# Altium project Simple_EEM_Controller.PrjPCB (part 1 of 5)
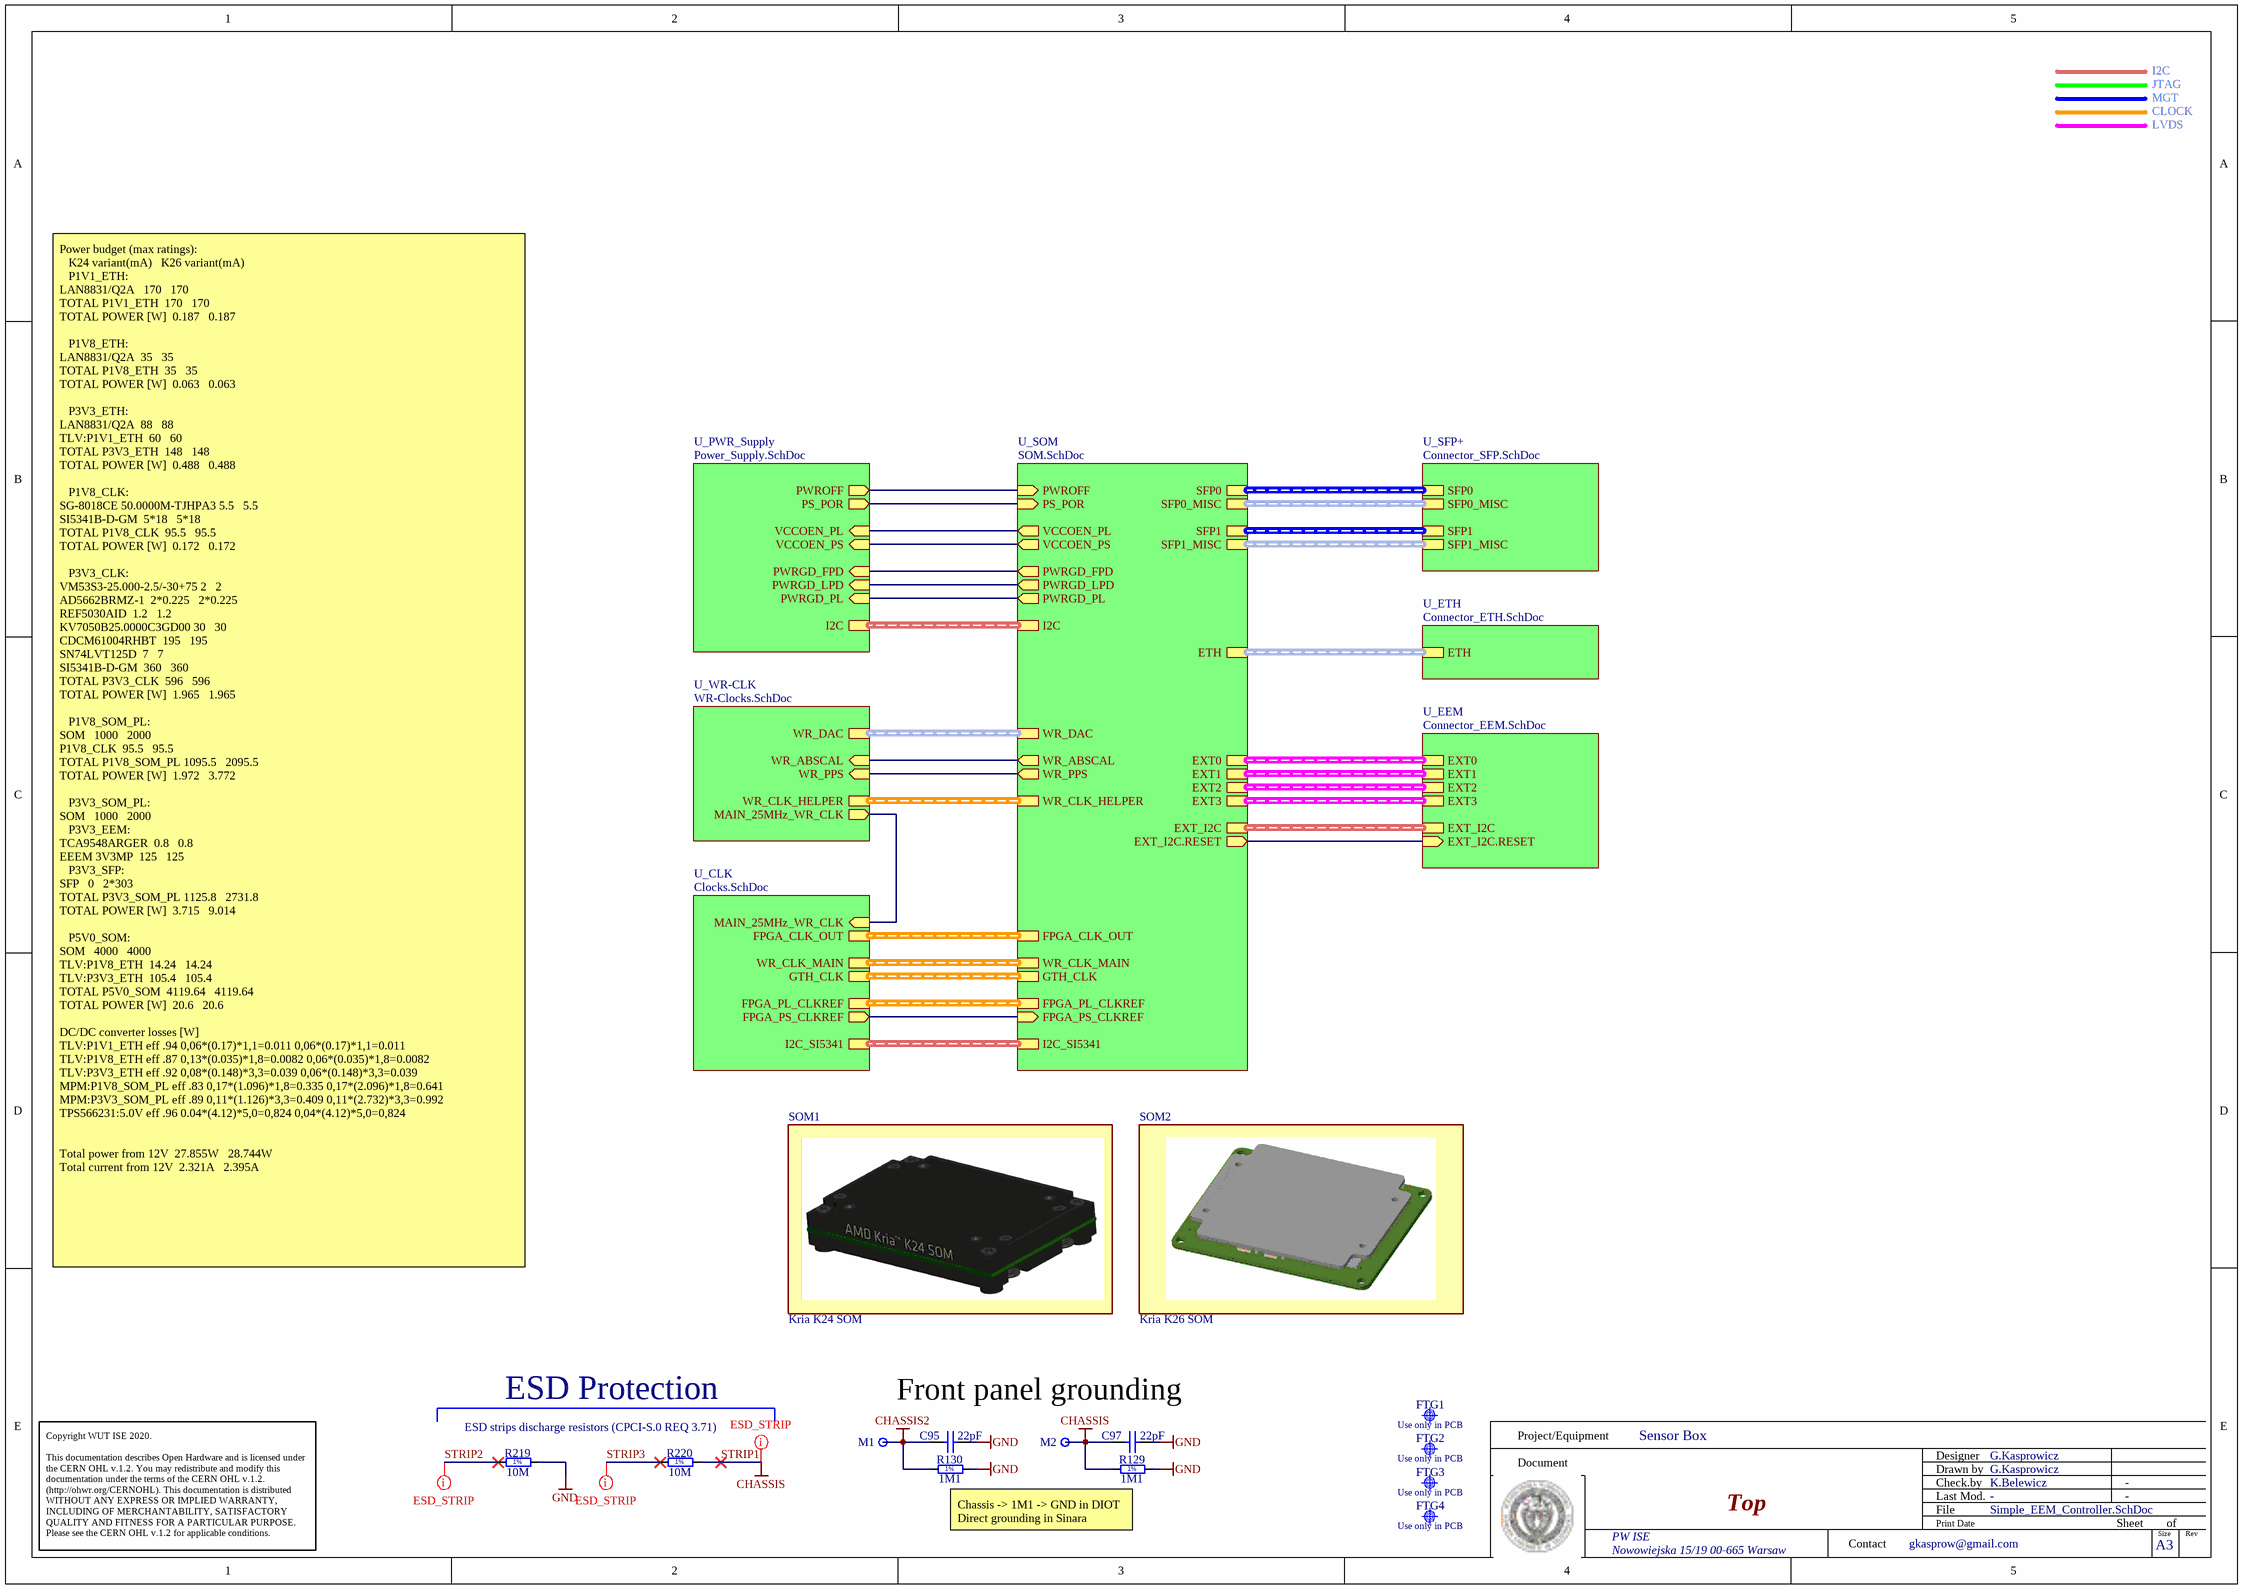
[diagram p0: Simple_EEM_Controller.SchDoc]
SheetTitle_Top: Simple EEM Controller; ProjectRev: 1.0; Project: Simple EEM Controller; CheckedBy: K.Belewicz
11 sheets, 476 parts. Net scope: hierarchical (ports join the sheet entries above them; power ports are global).
Board file: Simple_EEM_Controller.PcbDoc
Sheets:
  Simple_EEM_Controller.SchDoc
    U_SFP+ = Connector_SFP.SchDoc
    U_ETH = Connector_ETH.SchDoc
    U_EEM = Connector_EEM.SchDoc
    U_SOM = SOM.SchDoc
      Connector_SOM240_1 = Connector_SOM240_1.SchDoc
      Connector_SOM240_2 = Connector_SOM240_2.SchDoc
      Connector_SOM40 = Connector_SOM40.SchDoc
    U_PWR_Supply = Power_Supply.SchDoc
    U_CLK = Clocks.SchDoc
    U_WR-CLK = WR-Clocks.SchDoc

## Sheet Simple_EEM_Controller.SchDoc: =SheetTitle_Top
size 420 x 297 mm; EDA_Number: ARTIQ; Projet: Simple EEM Controller; Author: G.Kasprowicz; CompanyName: WUT ISE; DrawnBy: G.Kasprowicz; Organization: WUT ISE; Address1: PW ISE; Address2: Nowowiejska 15/19 00-665 Warsaw; Address3: gkasprow@gmail.com; Revision: 1.0; ModifiedBy: -; CheckedDate: -; Title2: Top; DivGrp: WUT ISE; Designer: G.Kasprowicz; ModifiedDate: -; ProjectName: Sensor Box

### Parts
C95  22pF  [CAPC1005X55N]
C97  22pF  [CAPC1005X55N]
FTG1  Use only in PCB  [FIDUCIAL_TOP_C100-200]  (no BOM)
FTG2  Use only in PCB  [FIDUCIAL_TOP_S100-200]  (no BOM)
FTG3  Use only in PCB  [FIDUCIAL_TOP_S100-200]  (no BOM)
FTG4  Use only in PCB  [FIDUCIAL_TOP_S100-200]  (no BOM)
M1  Plated Hole  [MTG300_600]  (value not drawn)  (no BOM)
M2  Plated Hole  [MTG300_600]  (value not drawn)  (no BOM)
R129  1M1  [RESC2012X60N]
R130  1M1  [RESC2012X60N]
R219  10M  [RESC2113X55N]
R220  10M  [RESC2113X55N]
SOM1  Kria K24 SOM  [Kria K24 SOM]
SOM2  Kria K26 SOM  [Kria K26 SOM]

### Sub-sheets
U_CLK = Clocks.SchDoc: GTH_CLK (harness GTH_CLK), MAIN_25MHz_WR_CLK (in), I2C_SI5341 (harness I2C), FPGA_PS_CLKREF (out), FPGA_PL_CLKREF (harness CLK_DIFF), FPGA_CLK_OUT (harness CLK_DIFF), WR_CLK_MAIN (harness CLK_DIFF)
U_EEM = Connector_EEM.SchDoc: EXT_I2C.RESET (in), EXT_I2C (harness EEM_I2C), EXT2 (harness EEM_LVDS), EXT0 (harness EEM_LVDS), EXT1 (harness EEM_LVDS), EXT3 (harness EEM_LVDS)
U_ETH = Connector_ETH.SchDoc: ETH (harness ETH)
U_PWR_Supply = Power_Supply.SchDoc: PWROFF (out), PS_POR (out), VCCOEN_PL (in), VCCOEN_PS (in), PWRGD_FPD (in), PWRGD_LPD (in), PWRGD_PL (in), I2C (harness I2C)
U_SFP+ = Connector_SFP.SchDoc: SFP0 (harness SFP), SFP0_MISC (harness SFP_MISC), SFP1 (harness SFP), SFP1_MISC (harness SFP_MISC)
U_SOM = SOM.SchDoc: SFP0 (harness SFP), SFP0_MISC (harness SFP_MISC), SFP1 (harness SFP), SFP1_MISC (harness SFP_MISC), ETH (harness ETH), EXT2 (harness EEM_LVDS), EXT0 (harness EEM_LVDS), EXT1 (harness EEM_LVDS), EXT3 (harness EEM_LVDS), EXT_I2C (harness EEM_I2C), PWROFF (in), PS_POR (in), PWRGD_FPD (out), VCCOEN_PS (out), PWRGD_PL (out), PWRGD_LPD (out), VCCOEN_PL (out), EXT_I2C.RESET (out), I2C (harness I2C), GTH_CLK (harness GTH_CLK), WR_ABSCAL (out), WR_PPS (out), WR_CLK_HELPER (harness CLK_DIFF), FPGA_PS_CLKREF (in), WR_DAC (harness WR_DAC_H), FPGA_PL_CLKREF (harness CLK_DIFF), WR_CLK_MAIN (harness CLK_DIFF), FPGA_CLK_OUT (harness CLK_DIFF), I2C_SI5341 (harness I2C)
U_WR-CLK = WR-Clocks.SchDoc: WR_DAC (harness WR_DAC_H), WR_CLK_HELPER (harness CLK_DIFF), WR_PPS (in), WR_ABSCAL (in), MAIN_25MHz_WR_CLK (out)

### Nets
CHASSIS: C97.1 M2.1 R129.1 R220.2  [also labelled STRIP1]
CHASSIS2: C95.1 M1.1 R130.1
GND: C95.2 C97.2 R129.2 R130.2 R219.2
EXT_I2C.RESET: sheet U_EEM/EXT_I2C.RESET, sheet U_SOM/EXT_I2C.RESET
HDA.HDA00_CC: sheet U_SOM/WR_ABSCAL, sheet U_WR-CLK/WR_ABSCAL
HDA.HDA01: sheet U_SOM/WR_PPS, sheet U_WR-CLK/WR_PPS
MAIN_25MHz_WR_CLK: sheet U_CLK/MAIN_25MHz_WR_CLK, sheet U_WR-CLK/MAIN_25MHz_WR_CLK
MIO46: sheet U_SOM/FPGA_PS_CLKREF, sheet U_CLK/FPGA_PS_CLKREF
PS_POR: sheet U_SOM/PS_POR, sheet U_PWR_Supply/PS_POR
PWRGD_FPD_M2C: sheet U_SOM/PWRGD_FPD, sheet U_PWR_Supply/PWRGD_FPD
PWRGD_LPD_M2C: sheet U_SOM/PWRGD_LPD, sheet U_PWR_Supply/PWRGD_LPD
PWRGD_PL_M2C: sheet U_SOM/PWRGD_PL, sheet U_PWR_Supply/PWRGD_PL
PWROFF_C2M: sheet U_SOM/PWROFF, sheet U_PWR_Supply/PWROFF
STRIP2: R219.1
STRIP3: R220.1
VCCOEN_PL_M2C: sheet U_SOM/VCCOEN_PL, sheet U_PWR_Supply/VCCOEN_PL
VCCOEN_PS_M2C: sheet U_SOM/VCCOEN_PS, sheet U_PWR_Supply/VCCOEN_PS

### Buses and harness runs
harness sheet U_CLK/FPGA_CLK_OUT = sheet U_SOM/FPGA_CLK_OUT
harness sheet U_CLK/FPGA_PL_CLKREF = sheet U_SOM/FPGA_PL_CLKREF
harness sheet U_CLK/GTH_CLK = sheet U_SOM/GTH_CLK
harness sheet U_CLK/I2C_SI5341 = sheet U_SOM/I2C_SI5341
harness sheet U_CLK/WR_CLK_MAIN = sheet U_SOM/WR_CLK_MAIN
harness sheet U_EEM/EXT0 = sheet U_SOM/EXT0
harness sheet U_EEM/EXT1 = sheet U_SOM/EXT1
harness sheet U_EEM/EXT2 = sheet U_SOM/EXT2
harness sheet U_EEM/EXT3 = sheet U_SOM/EXT3
harness sheet U_EEM/EXT_I2C = sheet U_SOM/EXT_I2C
harness sheet U_ETH/ETH = sheet U_SOM/ETH
harness sheet U_PWR_Supply/I2C = sheet U_SOM/I2C
harness sheet U_SFP+/SFP0 = sheet U_SOM/SFP0
harness sheet U_SFP+/SFP0_MISC = sheet U_SOM/SFP0_MISC
harness sheet U_SFP+/SFP1 = sheet U_SOM/SFP1
harness sheet U_SFP+/SFP1_MISC = sheet U_SOM/SFP1_MISC
harness sheet U_SOM/WR_CLK_HELPER = sheet U_WR-CLK/WR_CLK_HELPER
harness sheet U_SOM/WR_DAC = sheet U_WR-CLK/WR_DAC

### Layout directives
net class ESD_STRIP: CHASSIS, STRIP2, STRIP3

### Notes on the sheet
- I2C
- JTAG
- MGT
- CLOCK
- LVDS
- Power budget (max ratings):
  K24 variant(mA)	 	K26 variant(mA)
  P1V1_ETH:
  LAN8831/Q2A 		170			170
  TOTAL P1V1_ETH		170			170
  TOTAL POWER [W]		0.187			0.187
  P1V8_ETH:
  LAN8831/Q2A		35			35
  TOTAL P1V8_ETH		35			35
  TOTAL POWER [W]		0.063			0.063
  P3V3_ETH:
  LAN8831/Q2A		88			88
  TLV:P1V1_ETH		60			60
  TOTAL P3V3_ETH		148			148
  TOTAL POWER [W]		0.488			0.488
  P1V8_CLK:
  SG-8018CE 50.0000M-TJHPA3	5.5			5.5
  SI5341B-D-GM		5*18			5*18
  TOTAL P1V8_CLK		95.5			95.5
  TOTAL POWER [W]		0.172			0.172
  P3V3_CLK:
  VM53S3-25.000-2.5/-30+75	2			2
  AD5662BRMZ-1		2*0.225			2*0.225
  REF5030AID		1.2			1.2
  KV7050B25.0000C3GD00	30			30
  CDCM61004RHBT		195			195
  SN74LVT125D		7			7
  SI5341B-D-GM		360			360
  TOTAL P3V3_CLK		596			596
  TOTAL POWER [W]		1.965			1.965
  P1V8_SOM_PL:
  SOM			1000			2000
  P1V8_CLK		95.5			95.5
  TOTAL P1V8_SOM_PL	1095.5			2095.5
  TOTAL POWER [W]		1.972			3.772
  P3V3_SOM_PL:
  SOM			1000			2000
  P3V3_EEM:
  TCA9548ARGER		0.8			0.8
  EEEM 3V3MP		125			125
  P3V3_SFP:
  SFP			0			2*303
  TOTAL P3V3_SOM_PL	1125.8			2731.8
  TOTAL POWER [W]		3.715			9.014
  P5V0_SOM:
  SOM			4000			4000
  TLV:P1V8_ETH		14.24			14.24
  TLV:P3V3_ETH		105.4			105.4
  TOTAL P5V0_SOM		4119.64			4119.64
  TOTAL POWER [W]		20.6			20.6
  DC/DC converter losses [W]
  TLV:P1V1_ETH eff .94	0,06*(0.17)*1,1=0.011	0,06*(0.17)*1,1=0.011
  TLV:P1V8_ETH eff .87	0,13*(0.035)*1,8=0.0082	0,06*(0.035)*1,8=0.0082
  TLV:P3V3_ETH eff .92	0,08*(0.148)*3,3=0.039	0,06*(0.148)*3,3=0.039
  MPM:P1V8_SOM_PL eff .83	0,17*(1.096)*1,8=0.335	0,17*(2.096)*1,8=0.641
  MPM:P3V3_SOM_PL eff .89	0,11*(1.126)*3,3=0.409	0,11*(2.732)*3,3=0.992
  TPS566231:5.0V eff .96	0.04*(4.12)*5,0=0,824	0,04*(4.12)*5,0=0,824
  Total power from 12V 	27.855W			28.744W
  Total current from 12V 	2.321A			2.395A
- ESD Protection
- Front panel grounding
- ESD strips discharge resistors (CPCI-S.0 REQ 3.71)
- Chassis -> 1M1 -> GND in DIOT
  Direct grounding in Sinara
- Project/Equipment
- Document
- Designer
- Drawn by
- Check.by
- Copyright WUT ISE 2020.
  This documentation describes Open Hardware and is licensed under the CERN OHL v.1.2. You may redistribute and modify this documentation under the terms of the CERN OHL v.1.2. (http://ohwr.org/CERNOHL). This documentation is distributed WITHOUT ANY EXPRESS OR IMPLIED WARRANTY, INCLUDING OF MERCHANTABILITY, SATISFACTORY QUALITY AND FITNESS FOR A PARTICULAR PURPOSE. Please see the CERN OHL v.1.2 for applicable conditions.
- Contact
- File
- Last Mod.
- Print Date
- Sheet
- Size
- A3
- of
- Rev
- (in symbol R0805_1M1_1%_0.125W_100PPM) 1%
- (in symbol R0805_10M_1%_0.125W_100PPM_VISHAY_CRCW e3) 1%

### Library data of the parts
C95 C97 = CC0402_22PF_50V_5%_C0G: Non-polarised capacitor; Part Description: SMD Multilayer Chip Ceramic Capacitor; Manufacturer: GENERIC; Manufacturer1 Part Number: C0402C220J5GACTU; Voltage: 50V; TC: C0G/NP0; Tolerance: ±5%; Part Number: CC0402_22PF_50V_5%_C0G; Component Kind: Standard; Component Type: Standard; Pin Count: 2; Value: 22pF; Status: Preferred; Manufacturer Part Number: CC0402_22PF_50V_5%_C0G; Case: 0402; Mounted: Yes; Socket: No; SMD: Yes; Manufacturer1 Example: KEMET; Manufacturer1 ComponentHeight: 0.55mm; HelpURL: \\cern.ch\dfs\Applications\Altium\Datasheets\CC0402_C0G_KEMET_(Commercial Grade).pdf; Author: CERN DEM JLC; CreateDate: 2007-12-03; LatestRevisionDate: 2007-12-03; Sense: No
FTG1 = FIDUCIAL_TARGET_C100-200: Fiducial Target; Part Description: Round Fiducial Target, Top Layer, 1.0mm, Top Solder 2.0mm, Keepout =2.0mm; Mounted: No; Part Number: FIDUCIAL_TARGET_C100-200; Component Type: Standard (No BOM); Pin Count: 1; Family: Fiducial; Socket: No; SMD: Yes; Sense: No; Status: None; ComponentHeight: 0mm; HelpURL: Undefined; Author: CERN DEM JLC; CreateDate: 09.02.2010; LatestRevisionDate: 04.04.2012; PackageDescription: Round Fiducial Target, Top Layer, 1.0mm, Top Solder 2.0mm, Keepout =2.0mm
FTG2-FTG4 = FIDUCIAL_TARGET_S100-200: Fiducial Target; Part Description: Square Fiducial Target, Top Layer, 1.0mm, Top Solder 2.0mm, Keepout =2.0mm; Mounted: No; Part Number: FIDUCIAL_TARGET_S100-200; Component Type: Standard (No BOM); Pin Count: 1; Family: Fiducial; Socket: No; SMD: Yes; Sense: No; Status: None; ComponentHeight: 0mm; HelpURL: Undefined; Author: CERN DEM JLC; CreateDate: 09.02.2010; LatestRevisionDate: 04.04.2012; PackageDescription: Square Fiducial Target, Top Layer, 1.0mm, Top Solder 2.0mm, Keepout =2.0mm
M1 M2 = PLATED_HOLE3.0_PAD6.0: Single Terminal Socket; Part Description: Plated Through Hole: Hole Dia.=3.0mm Pad Dia.=6.0mm; Mounted: No; Table: Pads; Part Number: PLATED_HOLE3.0_PAD6.0; Component Type: Standard (No BOM); Designator: Single Terminal Socket; Library Reference: Single Terminal Socket; Pin Count: 1; Family: Plated Hole; Socket: No; SMD: No; Status: None; ComponentHeight: 0mm; Author: CERN DEM JLC; CreateDate: 26.05.2008; LatestRevisionDate: 26.05.2008; PackageDescription: Plated Through Hole: Hole Dia.=3.0mm Pad Dia.=6.0mm
R129 R130 = R0805_1M1_1%_0.125W_100PPM: Resistor - 1%; Part Description: General Purpose Thick Film Chip Resistor; Manufacturer: GENERIC; Manufacturer1 Part Number: NRC10F1104TRF; PressFit: No; Part Number: R0805_1M1_1%_0.125W_100PPM; Component Kind: Standard; Component Type: Standard; Pin Count: 2; Value: 1M1; Status: Preferred; Manufacturer Part Number: R0805_1M1_1%_0.125W_100PPM; Case: 0805; Mounted: Yes; Sense: No; Socket: No; SMD: Yes; Manufacturer1 Example: NIC COMPONENT; Manufacturer1 ComponentHeight: 0.6mm; HelpURL: \\cern.ch\dfs\Applications\Altium\Datasheets\R0805_NIC_NRC.pdf; Author: CERN DEM JLC; CreateDate: 03/12/2007; LatestRevisionDate: 13/03/2008
R219 R220 = R0805_10M_1%_0.125W_100PPM_VISHAY_CRCW e3: Resistor - 1%; Part Description: 150V, Standard Thick Film Chip Resistor; Manufacturer: VISHAY DALE; Manufacturer Part Number: CRCW080510M0FKEA; Power: 0.125W; TC: ±100ppm/°C; PressFit: No; Part Number: R0805_10M_1%_0.125W_100PPM_VISHAY_CRCW e3; Component Kind: Standard; Component Type: Standard; Pin Count: 2; Value: 10M; Status: None; Tolerance: ±1%; Case: 0805; Mounted: Yes; Sense: No; Socket: No; SMD: Yes; ComponentHeight: 0.5mm; HelpURL: \\cern.ch\dfs\Applications\Altium\Datasheets\R0805_VISHAY_CRCW e3.pdf; Author: CERN DEM BC; CreateDate: 2019-11-12; LatestRevisionDate: 2019-11-12
SOM1 = K24: Manufacturer: AMD; Part Number: Kria K24 SOM
SOM2 = K26: Manufacturer: AMD; Part Number: Kria K26 SOM

## Sheet Connector_SFP.SchDoc: =SheetTitle_Top
size 420 x 297 mm; EDA_Number: ARTIQ; Projet: Simple EEM Controller; Author: G.Kasprowicz; CompanyName: WUT ISE; DrawnBy: G.Kasprowicz; Organization: WUT ISE; Address1: PW ISE; Address2: Nowowiejska 15/19 00-665 Warsaw; Address3: gkasprow@gmail.com; Revision: 1.0; ModifiedBy: -; CheckedDate: -; Title2: Connector SFP+; DivGrp: WUT ISE; Designer: G.Kasprowicz; ModifiedDate: -; ProjectName: Sensor Box
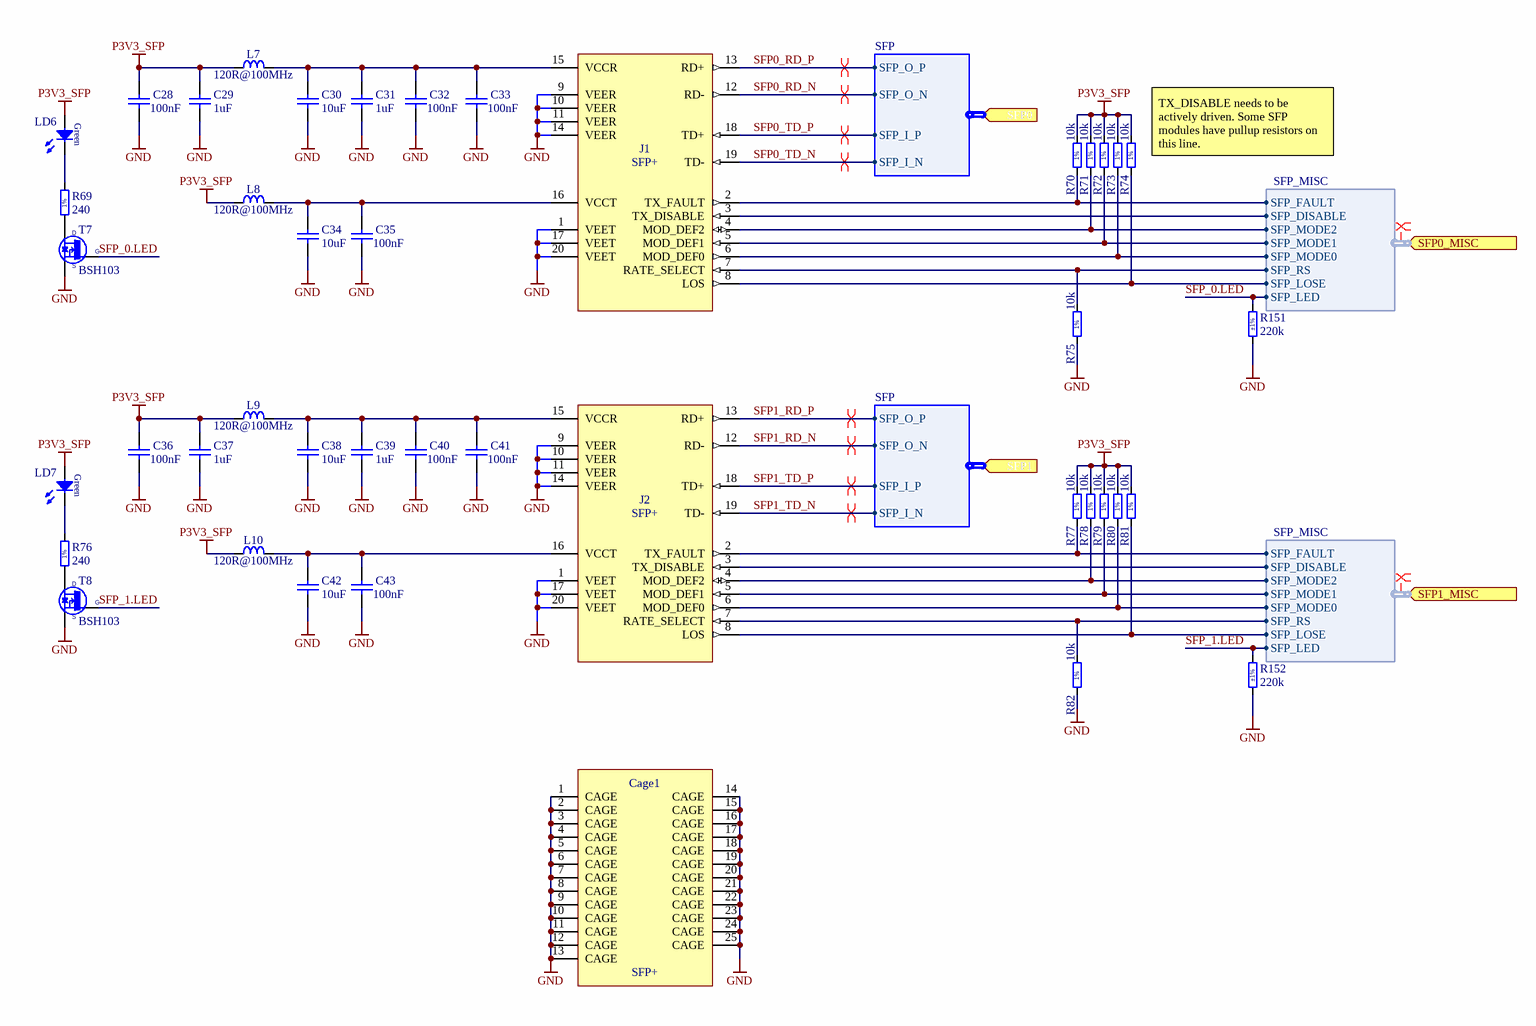
[diagram p1: Connector_SFP.SchDoc]

### Parts
C28  100nF  [CAPC1005X55N]
C29  1uF  [CAPC1005X55N]
C30  10uF  [CAPC1608X80N]
C31  1uF  [CAPC1005X55N]
C32  100nF  [CAPC1005X55N]
C33  100nF  [CAPC1005X55N]
C34  10uF  [CAPC1608X80N]
C35  100nF  [CAPC1005X55N]
C36  100nF  [CAPC1005X55N]
C37  1uF  [CAPC1005X55N]
C38  10uF  [CAPC1608X80N]
C39  1uF  [CAPC1005X55N]
C40  100nF  [CAPC1005X55N]
C41  100nF  [CAPC1005X55N]
C42  10uF  [CAPC1608X80N]
C43  100nF  [CAPC1005X55N]
Cage1  SFP+  [TYCO_2007263-1]
J1  SFP+  [MOLEX_74441-0001]
J2  SFP+  [MOLEX_74441-0001]
L7  120R@100MHz  [INDC1608X65N]
L8  120R@100MHz  [INDC1608X65N]
L9  120R@100MHz  [INDC1608X65N]
L10  120R@100MHz  [INDC1608X65N]
LD6  Green  [LED_AVAGO_HSME-C120]  (value not drawn)
LD7  Green  [LED_AVAGO_HSME-C120]  (value not drawn)
R69  240  [RESC1005X40N]
R70  10k  [RESC1005X40N]
R71  10k  [RESC1005X40N]
R72  10k  [RESC1005X40N]
R73  10k  [RESC1005X40N]
R74  10k  [RESC1005X40N]
R75  10k  [RESC1005X40N]
R76  240  [RESC1005X40N]
R77  10k  [RESC1005X40N]
R78  10k  [RESC1005X40N]
R79  10k  [RESC1005X40N]
R80  10k  [RESC1005X40N]
R81  10k  [RESC1005X40N]
R82  10k  [RESC1005X40N]
R151  220k  Tolerance: ±1%  [RESC1005X40N]
R152  220k  Tolerance: ±1%  [RESC1005X40N]
T7  BSH103  [SOT95P230X110-3N]
T8  BSH103  [SOT95P230X110-3N]

### Ports
SFP0 (in, harness SFP), SFP0_MISC (in, harness SFP_MISC), SFP1 (in, harness SFP), SFP1_MISC (in, harness SFP_MISC)

### Harnesses
SFP_MISC: SFP_FAULT, SFP_DISABLE, SFP_MODE2, SFP_MODE1, SFP_MODE0, SFP_RS, SFP_LOSE, SFP_LED
SFP: SFP_O_P, SFP_O_N, SFP_I_P, SFP_I_N

### Nets
GND: C28.1 C29.1 C30.1 C31.1 C32.1 C33.1 C34.1 C35.1 C36.1 C37.1 C38.1 C39.1 C40.1 C41.1 C42.1 C43.1 Cage1.1(CAGE) Cage1.2(CAGE) Cage1.3(CAGE) Cage1.4(CAGE) Cage1.5(CAGE) Cage1.6(CAGE) Cage1.7(CAGE) Cage1.8(CAGE) Cage1.9(CAGE) Cage1.10(CAGE) Cage1.11(CAGE) Cage1.12(CAGE) Cage1.13(CAGE) Cage1.14(CAGE) Cage1.15(CAGE) Cage1.16(CAGE) Cage1.17(CAGE) Cage1.18(CAGE) Cage1.19(CAGE) Cage1.20(CAGE) Cage1.21(CAGE) Cage1.22(CAGE) Cage1.23(CAGE) Cage1.24(CAGE) Cage1.25(CAGE) J1.1(VEET) J1.9(VEER) J1.10(VEER) J1.11(VEER) J1.14(VEER) J1.17(VEET) J1.20(VEET) J2.1(VEET) J2.9(VEER) J2.10(VEER) J2.11(VEER) J2.14(VEER) J2.17(VEET) J2.20(VEET) R75.1 R82.1 R151.1 R152.1 T7.2(S) T8.2(S)
P3V3_SFP: C28.2 C29.2 C36.2 C37.2 L7.1 L8.1 L9.1 L10.1 LD6.2(A) LD7.2(A) R70.2 R71.2 R72.2 R73.2 R74.2 R77.2 R78.2 R79.2 R80.2 R81.2
HDB.HDB00_CC: J1.2(TX_FAULT) R70.1 ; port SFP0_MISC.SFP_FAULT
HDB.HDB01: J1.3(TX_DISABLE) ; port SFP0_MISC.SFP_DISABLE
HDB.HDB02: J1.4(MOD_DEF2) R71.1 ; port SFP0_MISC.SFP_MODE2
HDB.HDB03: J1.5(MOD_DEF1) R72.1 ; port SFP0_MISC.SFP_MODE1
HDB.HDB04: J1.6(MOD_DEF0) R73.1 ; port SFP0_MISC.SFP_MODE0
HDB.HDB05: J1.7(RATE_SELECT) R75.2 ; port SFP0_MISC.SFP_RS
HDB.HDB06: J1.8(LOS) R74.1 ; port SFP0_MISC.SFP_LOSE
HDB.HDB08_CC: J2.2(TX_FAULT) R77.1 ; port SFP1_MISC.SFP_FAULT
HDB.HDB09: J2.3(TX_DISABLE) ; port SFP1_MISC.SFP_DISABLE
HDB.HDB10: J2.4(MOD_DEF2) R78.1 ; port SFP1_MISC.SFP_MODE2
HDB.HDB11: J2.5(MOD_DEF1) R79.1 ; port SFP1_MISC.SFP_MODE1
HDB.HDB12: J2.6(MOD_DEF0) R80.1 ; port SFP1_MISC.SFP_MODE0
HDB.HDB13: J2.7(RATE_SELECT) R82.2 ; port SFP1_MISC.SFP_RS
HDB.HDB14: J2.8(LOS) R81.1 ; port SFP1_MISC.SFP_LOSE
SFP0_RD_N: J1.12(RD-) ; port SFP0.SFP_O_N  [project net GTH_DATA.GTH_DP0_C2M_N]
SFP0_RD_P: J1.13(RD+) ; port SFP0.SFP_O_P  [project net GTH_DATA.GTH_DP0_C2M_P]
SFP0_TD_N: J1.19(TD-) ; port SFP0.SFP_I_N  [project net GTH_DATA.GTH_DP0_M2C_N]
SFP0_TD_P: J1.18(TD+) ; port SFP0.SFP_I_P  [project net GTH_DATA.GTH_DP0_M2C_P]
SFP1_RD_N: J2.12(RD-) ; port SFP1.SFP_O_N  [project net GTH_DATA.GTH_DP1_C2M_N]
SFP1_RD_P: J2.13(RD+) ; port SFP1.SFP_O_P  [project net GTH_DATA.GTH_DP1_C2M_P]
SFP1_TD_N: J2.19(TD-) ; port SFP1.SFP_I_N  [project net GTH_DATA.GTH_DP1_M2C_N]
SFP1_TD_P: J2.18(TD+) ; port SFP1.SFP_I_P  [project net GTH_DATA.GTH_DP1_M2C_P]
SFP_0.LED: R151.2 T7.1(G) ; port SFP0_MISC.SFP_LED  [project net HDB.HDB07]
SFP_1.LED: R152.2 T8.1(G) ; port SFP1_MISC.SFP_LED  [project net HDB.HDB15]
NetC30_2: C30.2 C31.2 C32.2 C33.2 J1.15(VCCR) L7.2
NetC34_2: C34.2 C35.2 J1.16(VCCT) L8.2
NetC38_2: C38.2 C39.2 C40.2 C41.2 J2.15(VCCR) L9.2
NetC42_2: C42.2 C43.2 J2.16(VCCT) L10.2
NetLD6_1: LD6.1(C) R69.2
NetLD7_1: LD7.1(C) R76.2
NetR69_1: R69.1 T7.3(D)
NetR76_1: R76.1 T8.3(D)

### Layout directives
differential pair; differential pair class Diff_100Ohm: GTH_DATA.GTH_DP0_C2M_N, GTH_DATA.GTH_DP0_C2M_P, GTH_DATA.GTH_DP0_M2C_N, GTH_DATA.GTH_DP0_M2C_P, GTH_DATA.GTH_DP1_C2M_N, GTH_DATA.GTH_DP1_C2M_P, GTH_DATA.GTH_DP1_M2C_N, GTH_DATA.GTH_DP1_M2C_P
net class SFP0: (no net found under the mark)
net class SFP1: (no net found under the mark)

### Notes on the sheet
- TX_DISABLE needs to be actively driven. Some SFP modules have pullup resistors on this line.
- Project/Equipment
- Document
- Designer
- Drawn by
- Check.by
- Copyright WUT ISE 2020.
  This documentation describes Open Hardware and is licensed under the CERN OHL v.1.2. You may redistribute and modify this documentation under the terms of the CERN OHL v.1.2. (http://ohwr.org/CERNOHL). This documentation is distributed WITHOUT ANY EXPRESS OR IMPLIED WARRANTY, INCLUDING OF MERCHANTABILITY, SATISFACTORY QUALITY AND FITNESS FOR A PARTICULAR PURPOSE. Please see the CERN OHL v.1.2 for applicable conditions.
- Contact
- File
- Last Mod.
- Print Date
- Sheet
- Size
- A3
- of
- Rev
- (in symbol R0402_10K_1%_0.0625W_100PPM) 1%
- (in symbol R0402_240R_1%_0.0625W_100PPM) 1%

### Library data of the parts
C28 C32 C33 C35 C36 C40 C41 C43 = CC0402_100NF_16V_10%_X5R: Non-polarised capacitor; Part Description: SMD Multilayer Chip Ceramic Capacitor; Manufacturer: GENERIC; Manufacturer1 Part Number: GRM155R61C104KA88D; Voltage: 16V; TC: X5R; Tolerance: ±10%; Part Number: CC0402_100NF_16V_10%_X5R; Component Kind: Standard; Component Type: Standard; Pin Count: 2; Value: 100nF; Status: None; Manufacturer Part Number: CC0402_100NF_16V_10%_X5R; Case: 0402; Mounted: Yes; Socket: No; SMD: Yes; Sense: No; Manufacturer1 Example: MURATA; Manufacturer1 ComponentHeight: 0.55mm; HelpURL: \\cern.ch\dfs\Applications\Altium\Datasheets\CC0402_X5R_MURATA_GRM.pdf; Author: CERN DEM JLC; CreateDate: 10.12.2013; LatestRevisionDate: 10.12.2013
C29 C31 C37 C39 = CC0402_1UF_16V_10%_X5R: Non-polarised capacitor; Part Description: SMD Multilayer Chip Ceramic Capacitor; Manufacturer: GENERIC; Manufacturer1 Part Number: C1005X5R1C105KT; Voltage: 16V; TC: X5R; Tolerance: ±10%; Part Number: CC0402_1UF_16V_10%_X5R; Component Kind: Standard; Component Type: Standard; Pin Count: 2; Value: 1uF; Status: Preferred; Manufacturer Part Number: CC0402_1UF_16V_10%_X5R; Case: 0402; Mounted: Yes; Socket: No; SMD: Yes; Sense: No; Manufacturer1 Example: TDK; Manufacturer1 ComponentHeight: 0.55mm; HelpURL: \\cern.ch\dfs\Applications\Altium\Datasheets\CC0402_X5R_TDK_C.pdf; Author: CERN DEM JLC; CreateDate: 2012-10-25; LatestRevisionDate: 2012-10-25
C30 C34 C38 C42 = CC0603_10UF_16V_20%_X5R: Non-polarised capacitor; Part Description: SMD Multilayer Chip Ceramic Capacitor; Manufacturer: GENERIC; Manufacturer1 Part Number: GRM188R61C106MA73D; Voltage: 16V; TC: X5R; Tolerance: ±20%; Part Number: CC0603_10UF_16V_20%_X5R; Component Kind: Standard; Component Type: Standard; Pin Count: 2; Value: 10uF; Status: None; Manufacturer Part Number: CC0603_10UF_16V_20%_X5R; Case: 0603; Mounted: Yes; Socket: No; SMD: Yes; Sense: No; Manufacturer1 Example: MURATA; Manufacturer1 ComponentHeight: 0.8mm; HelpURL: \\cern.ch\dfs\Applications\Altium\Datasheets\CC0603_X5R_MURATA_GRM.pdf; Author: CERN DEM MR; CreateDate: 02.03.2016; LatestRevisionDate: 02.03.2016
Cage1 = TYCO_2007263-1: SFP 1x2 Cage (25Pins); Part Description: 1x2 Press Fit SFP+ Cage with EMI Springs; Manufacturer: TYCO ELECTRONICS; Part Number: TYCO_2007263-1; Component Kind: Standard; Component Type: Standard; Pin Count: 25; Family: SFP+; Mounted: Yes; Socket: No; SMD: No; PressFit: Yes; Sense: No; Status: None; Manufacturer Part Number: 2007263-1; ComponentHeight: 9.7mm; HelpURL: \\cern.ch\dfs\Applications\Altium\Datasheets\TYCO_2007263-1.pdf; Author: CERN DEM JLC; CreateDate: 18.01.2017; LatestRevisionDate: 18.01.2017
J1 J2 = MOLEX_74441-0001: 20 Position SFP  Connector (Small Form-factor Pluggable); Part Description: 20 Position, Pitch 0.8mm SFP Receptacle (Small Form-factor Pluggable); Manufacturer: MOLEX; PressFit: No; Part Number: MOLEX_74441-0001; Component Kind: Standard; Component Type: Standard; Pin Count: 20; Family: SFP+; Mounted: Yes; Socket: No; SMD: Yes; Sense: No; Status: None; Manufacturer Part Number: 74441-0001; ComponentHeight: 5.4mm; HelpURL: \\cern.ch\dfs\Applications\Altium\Datasheets\MOLEX_74441-0001.pdf; ComponentLink1URL: \\cern.ch\dfs\Applications\Altium\Datasheets\MOLEX_SFP_Application.pdf; ComponentLink1Description: Application; Author: CERN DEM MR; CreateDate: 03.12.2015; LatestRevisionDate: 03.12.2015
L7-L10 = IND0603_MURATA_BLM18SG121TN1D: Inductor; Part Description: SMD EMIFIL Suppression Chip Ferrite Bead; Manufacturer: MURATA; Power: 3A; Resistance: 0.025R; Tolerance: ±25%; Part Number: IND0603_MURATA_BLM18SG121TN1D; Component Kind: Standard; Component Type: Standard; Pin Count: 2; Value: 120R@100MHz; Status: None; Manufacturer Part Number: BLM18SG121TN1D; Case: 0603; Mounted: Yes; Socket: No; SMD: Yes; Sense: No; ComponentHeight: 0.65mm; HelpURL: \\cern.ch\dfs\Applications\Altium\Datasheets\IND0603_MURATA_BLM18S.pdf; Author: CERN DEM JLC; CreateDate: 23.07.2014; LatestRevisionDate: 23.07.2014
LD6 LD7 = LED_AVAGO_HSME-C120: LED Green 1C 2A; Part Description: High Performance Right Angle Chip Green LED; Manufacturer: AVAGO TECHNOLOGIES; PressFit: No; Bonding: No; Part Number: LED_AVAGO_HSME-C120; Component Kind: Standard; Component Type: Standard; Color: Green; PackageDescription: Green Chip LED, 2-Leads, Body 1.7x1.1mm, Side Emitting Package; Manufacturer Part Number: HSME-C120; Pin Count: 2; Mounted: Yes; Socket: No; SMD: Yes; Sense: No; ComponentHeight: 0.7mm; HelpURL: \\cern.ch\dfs\Applications\Altium\Datasheets\LED_AVAGO_HSME-C120.pdf; ComponentLink1URL: \\cern.ch\dfs\Applications\Altium\Datasheets\LED_AVAGO_HSME-C110_DESIGN-GUIDE.pdf; ComponentLink1Description: Design Guide; Author: CERN DEM JMW; CreateDate: 22.07.2009; LatestRevisionDate: 20.06.2012
R69 R76 = R0402_240R_1%_0.0625W_100PPM: Resistor - 1%; Part Description: General Purpose Thick Film Chip Resistor; Manufacturer: GENERIC; Manufacturer1 Part Number: 232270672401L; TC: ±100ppm/°C; PressFit: No; Part Number: R0402_240R_1%_0.0625W_100PPM; Component Kind: Standard; Component Type: Standard; Pin Count: 2; Value: 240; Status: Not Recommended; Power: 0.0625W; Tolerance: ±1%; Manufacturer Part Number: R0402_240R_1%_0.0625W_100PPM; Case: 0402; Mounted: Yes; Sense: No; Socket: No; SMD: Yes; Manufacturer1 Example: YAGEO PHYCOMP; Manufacturer1 ComponentHeight: 0.4mm; HelpURL: \\cern.ch\dfs\Applications\Altium\Datasheets\R0402_Phycomp_RC0402.pdf; Author: CERN DEM JLC; CreateDate: 03.12.2007; LatestRevisionDate: 17.10.2012
R70-R75 R77-R82 = R0402_10K_1%_0.0625W_100PPM: Resistor - 1%; Part Description: General Purpose Thick Film Chip Resistor; Manufacturer: GENERIC; Manufacturer1 Part Number: 232270671003L; TC: ±100ppm/°C; PressFit: No; Part Number: R0402_10K_1%_0.0625W_100PPM; Component Kind: Standard; Component Type: Standard; Pin Count: 2; Value: 10k; Status: Not Recommended; Power: 0.0625W; Tolerance: ±1%; Manufacturer Part Number: R0402_10K_1%_0.0625W_100PPM; Case: 0402; Mounted: Yes; Sense: No; Socket: No; SMD: Yes; Manufacturer1 Example: YAGEO PHYCOMP; Manufacturer1 ComponentHeight: 0.4mm; HelpURL: \\cern.ch\dfs\Applications\Altium\Datasheets\R0402_Phycomp_RC0402.pdf; Author: CERN DEM JLC; CreateDate: 03.12.2007; LatestRevisionDate: 17.10.2012
R151 R152 = R0402_220K_1%_0.0625W_100PPM: Resistor - 1%; Part Description: General Purpose Thick Film Chip Resistor; Manufacturer: GENERIC; Manufacturer1 Part Number: 232270672204L; TC: ±100ppm/°C; PressFit: No; Part Number: R0402_220K_1%_0.0625W_100PPM; Component Kind: Standard; Component Type: Standard; Pin Count: 2; Value: 220k; Status: Not Recommended; Power: 0.0625W; Manufacturer Part Number: R0402_220K_1%_0.0625W_100PPM; Case: 0402; Mounted: Yes; Sense: No; Socket: No; SMD: Yes; Manufacturer1 Example: YAGEO PHYCOMP; Manufacturer1 ComponentHeight: 0.4mm; HelpURL: \\cern.ch\dfs\Applications\Altium\Datasheets\R0402_Phycomp_RC0402.pdf; Author: CERN DEM JLC; CreateDate: 03.12.2007; LatestRevisionDate: 17.10.2012
T7 T8 = BSH103: N-CHANNEL MOSFET WITH DIODE; Part Description: 30V 850mA N-Channel Enhancement Mode Field-Effect Transistor; Manufacturer: NEXPERIA; PressFit: No; Bonding: No; Part Number: BSH103; Component Kind: Standard; Component Type: Standard; Device: BSH103; PackageDescription: SOT23, 3 pin, Pitch 0.95mm - 1.3mm W X 2.9mm L X 1.1mm H, IPC Medium Density; Manufacturer Part Number: BSH103; Pin Count: 3; Case: SOT23-3; Mounted: Yes; Socket: No; SMD: Yes; Sense: No; ComponentHeight: 1.1mm; HelpURL: \\cern.ch\dfs\Applications\Altium\Datasheets\BSH103.pdf; Author: CERN DEM JLC; CreateDate: 16.03.2010; LatestRevisionDate: 20.06.2017

## Sheet Connector_ETH.SchDoc: =SheetTitle_Top
size 420 x 297 mm; EDA_Number: ARTIQ; Projet: Simple EEM Controller; Author: G.Kasprowicz; CompanyName: WUT ISE; DrawnBy: G.Kasprowicz; Organization: WUT ISE; Address1: PW ISE; Address2: Nowowiejska 15/19 00-665 Warsaw; Address3: gkasprow@gmail.com; Revision: 1.0; ModifiedBy: -; CheckedDate: -; Title2: Connector Ethernet; DivGrp: WUT ISE; Designer: G.Kasprowicz; ModifiedDate: -; ProjectName: Sensor Box
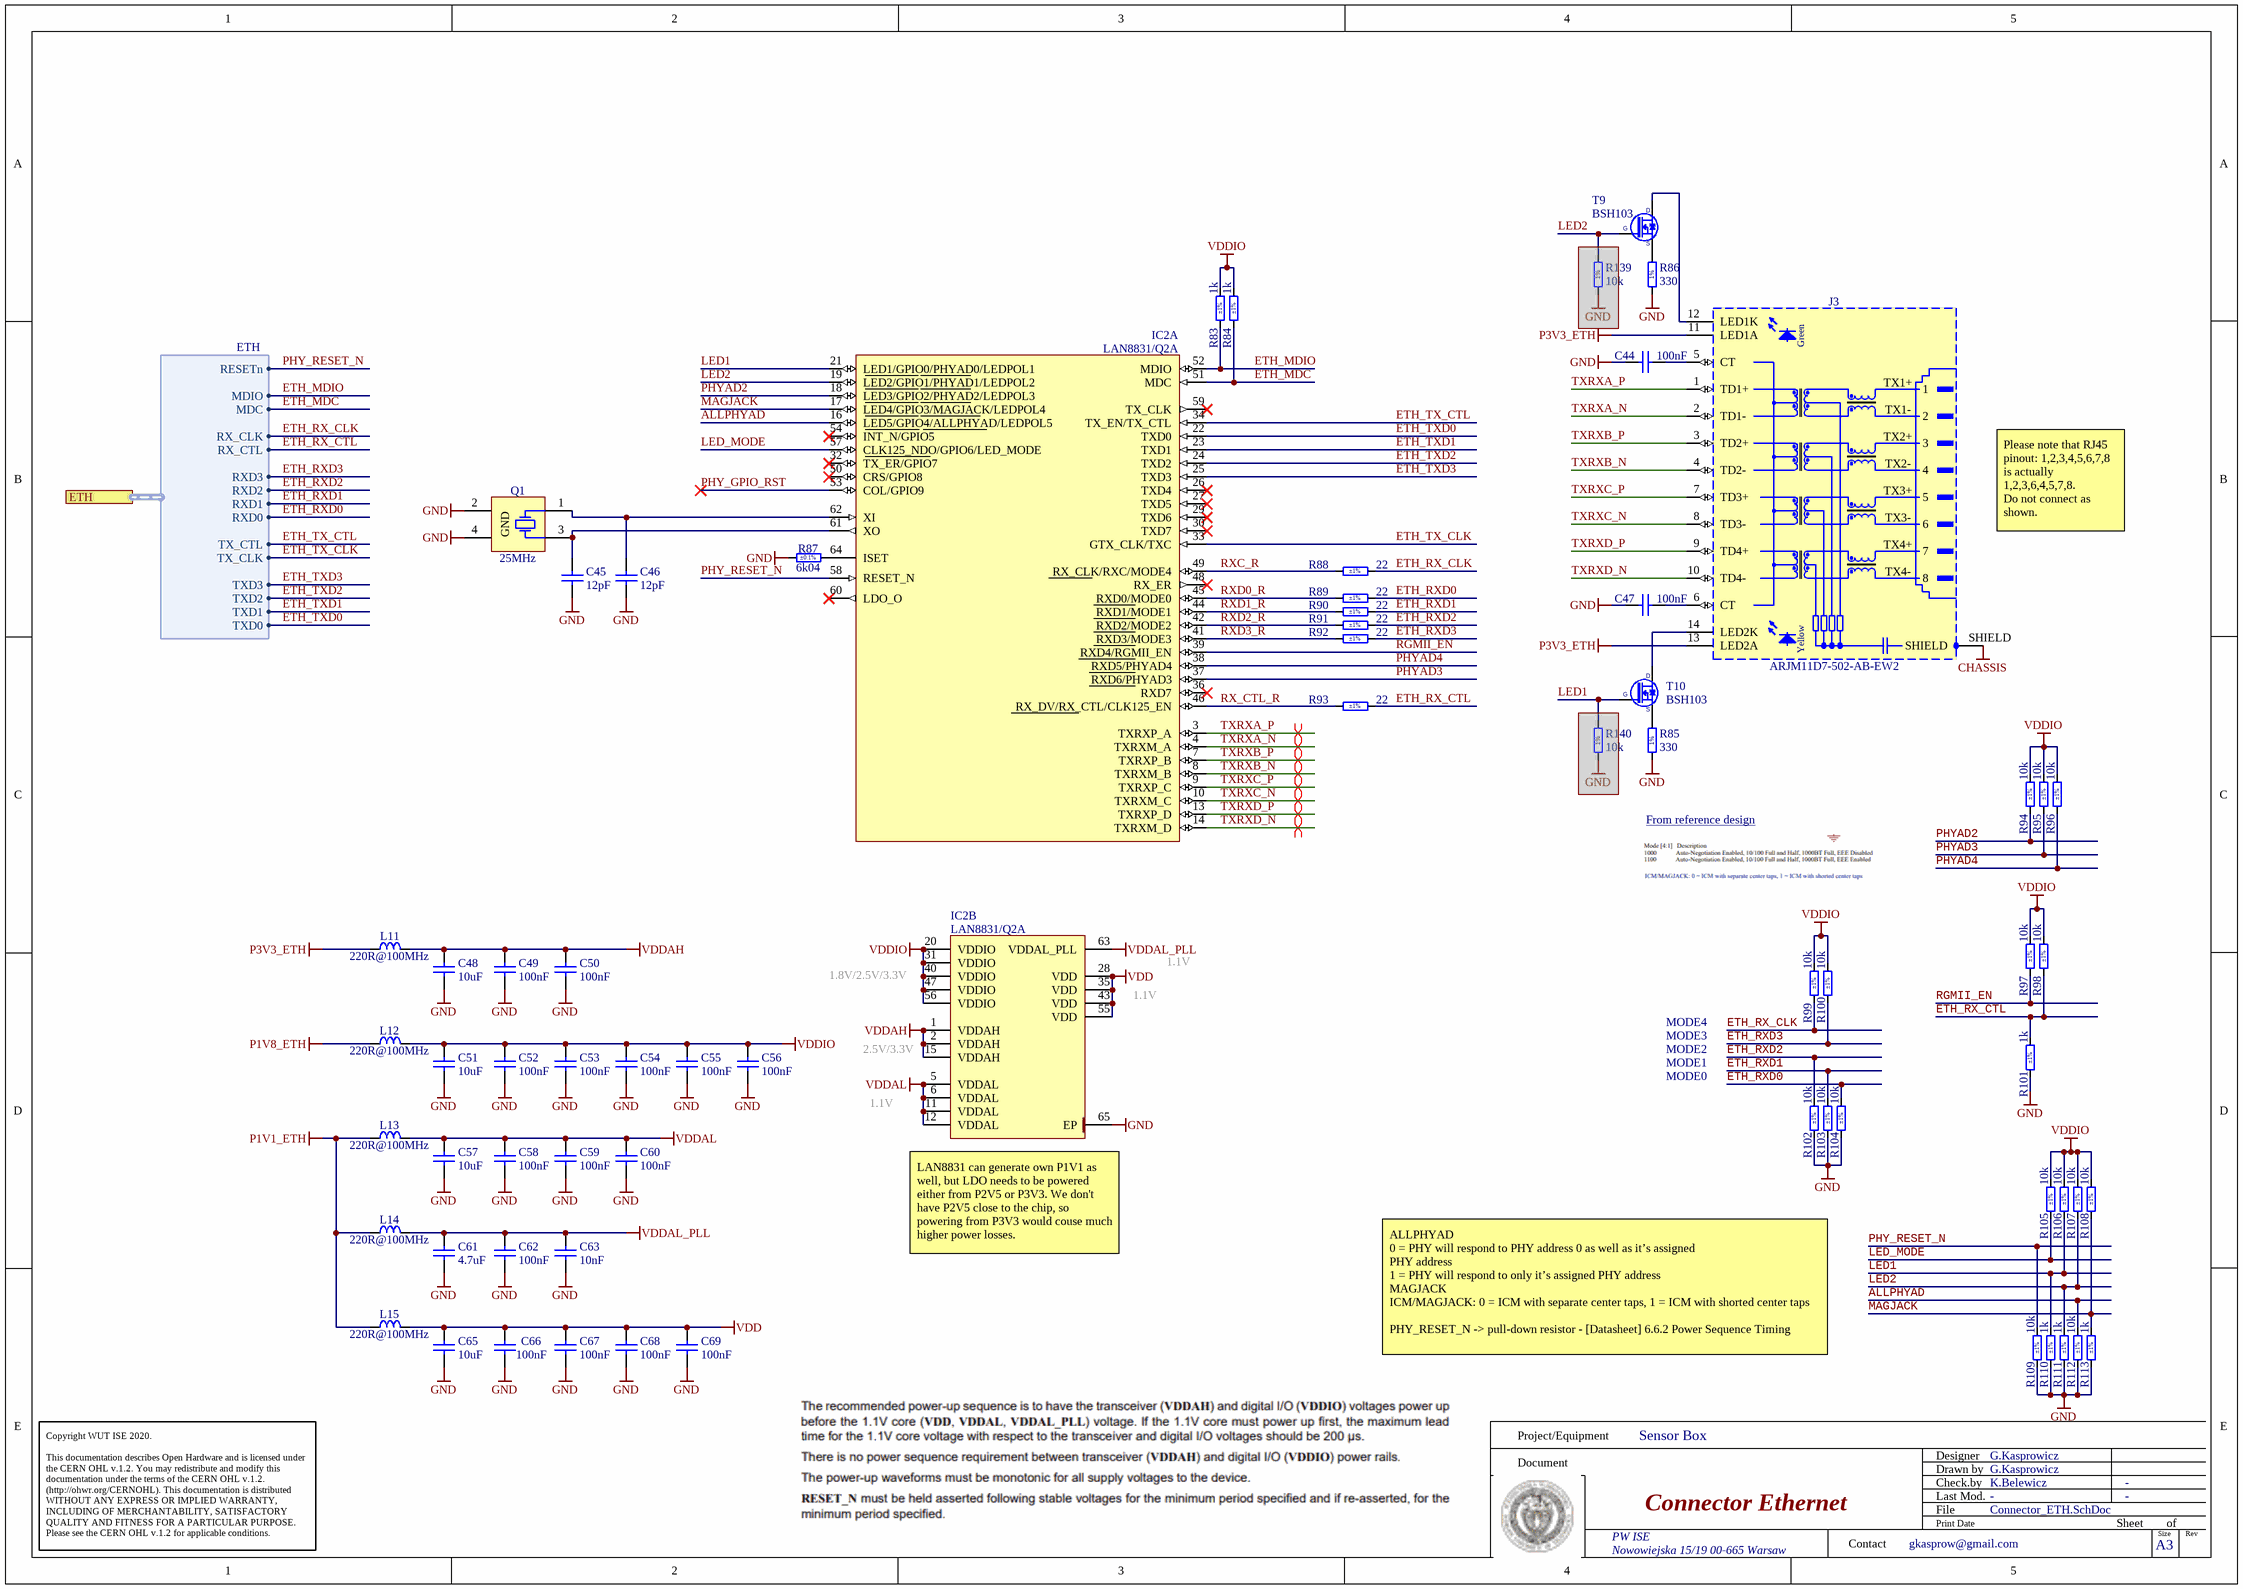
[diagram p2: Connector_ETH.SchDoc]

### Parts
(Parts that share a designator on the sheet are numbered #1, #2 ... from top to bottom, then left to right.)
C44  100nF  [CAPC1005X55N]
C45  12pF  [CAPC1005X61N]
C46  12pF  [CAPC1005X61N]
C47  100nF  [CAPC1005X55N]
C48  10uF  [CAPC1005X70N]
C49  100nF  [CAPC1005X55N]
C50  100nF  [CAPC1005X55N]
C51  10uF  [CAPC1005X70N]
C52  100nF  [CAPC1005X55N]
C53  100nF  [CAPC1005X55N]
C54  100nF  [CAPC1005X55N]
C55  100nF  [CAPC1005X55N]
C56  100nF  [CAPC1005X55N]
C57  10uF  [CAPC1005X70N]
C58  100nF  [CAPC1005X55N]
C59  100nF  [CAPC1005X55N]
C60  100nF  [CAPC1005X55N]
C61  4.7uF  [CAPC1005X55N]
C62  100nF  [CAPC1005X55N]
C63  10nF  [CAPC1005X55N]
C65  10uF  [CAPC1005X70N]
C66  100nF  [CAPC1005X55N]
C67  100nF  [CAPC1005X55N]
C68  100nF  [CAPC1005X55N]
C69  100nF  [CAPC1005X55N]
IC2  LAN8831/Q2A  [MICROCHIP_Q2A]  (parts A,B of 2)
J3  ARJM11D7-502-AB-EW2  [ABRACON-ARJM11D7-502-AB-EW2]
L11  220R@100MHz  [INDC2012X105N]
L12  220R@100MHz  [INDC2012X105N]
L13  220R@100MHz  [INDC2012X105N]
L14  220R@100MHz  [INDC2012X105N]
L15  220R@100MHz  [INDC2012X105N]
Q1  25MHz  [XTAL_NDK_NX3225GA]
R83  1k  Tolerance: ±1%  [RESC1005X40N]
R84  1k  Tolerance: ±1%  [RESC1005X40N]
R85  330  [RESC1608X55N]
R86  330  [RESC1608X55N]
R87  6k04  Tolerance: ±0.1%  [RESC1608X55N]
R88  22  Tolerance: ±1%  [RESC1005X40N]
R89  22  Tolerance: ±1%  [RESC1005X40N]
R90  22  Tolerance: ±1%  [RESC1005X40N]
R91  22  Tolerance: ±1%  [RESC1005X40N]
R92  22  Tolerance: ±1%  [RESC1005X40N]
R93  22  Tolerance: ±1%  [RESC1005X40N]
R94  10k  Tolerance: ±1%  [RESC1005X40N]
R95  10k  Tolerance: ±1%  [RESC1005X40N]
R96  10k  Tolerance: ±1%  [RESC1005X40N]
R97  10k  Tolerance: ±1%  [RESC1005X40N]
R98  10k  Tolerance: ±1%  [RESC1005X40N]
R99  10k  Tolerance: ±1%  [RESC1005X40N]
R100  10k  Tolerance: ±1%  [RESC1005X40N]
R101  1k  Tolerance: ±1%  [RESC1005X40N]
R102  10k  Tolerance: ±1%  [RESC1005X40N]
R103  10k  Tolerance: ±1%  [RESC1005X40N]
R104  10k  Tolerance: ±1%  [RESC1005X40N]
R105  10k  Tolerance: ±1%  [RESC1005X40N]
R106  10k  Tolerance: ±1%  [RESC1005X40N]
R107  10k  Tolerance: ±1%  [RESC1005X40N]
R108  10k  Tolerance: ±1%  [RESC1005X40N]
R109  10k  Tolerance: ±1%  [RESC1005X40N]
R110  1k  Tolerance: ±1%  [RESC1005X40N]
R111  1k  Tolerance: ±1%  [RESC1005X40N]
R112  10k  Tolerance: ±1%  [RESC1005X40N]
R113  1k  Tolerance: ±1%  [RESC1005X40N]
R139#1  10k  [RESC1005X40N]  (masked out: inside a compile mask, not in the netlist)
R140#1  10k  [RESC1005X40N]  (masked out: inside a compile mask, not in the netlist)
T9  BSH103  [SOT95P230X110-3N]
T10  BSH103  [SOT95P230X110-3N]

### Ports
ETH (harness ETH)

### Harnesses
ETH: RXD3, RXD2, RX_CLK, RX_CTL, RXD1, RXD0, TX_CTL, TX_CLK, TXD3, TXD2, TXD1, TXD0, MDIO, MDC, RESETn

### Nets
CHASSIS: J3.SHIELD
GND: C44.2 C45.1 C46.2 C47.2 C48.1 C49.2 C50.2 C51.1 C52.2 C53.2 C54.2 C55.2 C56.2 C57.1 C58.2 C59.2 C60.2 C61.1 C62.2 C63.1 C65.1 C66.2 C67.2 C68.2 C69.2 IC2.65(EP) Q1.2(GND) Q1.4(GND) R85.1 R86.1 R87.1 R101.1 R102.1 R103.1 R104.1 R109.2 R110.1 R111.1 R112.1 R113.1
P1V1_ETH: L13.1 L14.1 L15.1
P1V8_ETH: L12.1
P3V3_ETH: J3.11(LED1A) J3.13(LED2A) L11.1
VDD: C65.2 C66.1 C67.1 C68.1 C69.1 IC2.28(VDD) IC2.35(VDD) IC2.43(VDD) IC2.55(VDD) L15.2
VDDAH: C48.2 C49.1 C50.1 IC2.1(VDDAH) IC2.2(VDDAH) IC2.15(VDDAH) L11.2
VDDAL: C57.2 C58.1 C59.1 C60.1 IC2.5(VDDAL) IC2.6(VDDAL) IC2.11(VDDAL) IC2.12(VDDAL) L13.2
VDDAL_PLL: C61.2 C62.1 C63.2 IC2.63(VDDAL_PLL) L14.2
VDDIO: C51.2 C52.1 C53.1 C54.1 C55.1 C56.1 IC2.20(VDDIO) IC2.31(VDDIO) IC2.40(VDDIO) IC2.47(VDDIO) IC2.56(VDDIO) L12.2 R83.2 R84.2 R94.2 R95.2 R96.2 R97.2 R98.2 R99.2 R100.2 R105.2 R106.2 R107.2 R108.2
ALLPHYAD: IC2.16(LED5/GPIO4/ALLPHYAD/LEDPOL5) R112.2
ETH_MDC: IC2.51(MDC) R84.1 ; port ETH.MDC
ETH_MDIO: IC2.52(MDIO) R83.1 ; port ETH.MDIO
ETH_RX_CLK: R88.2 R99.1 ; port ETH.RX_CLK
ETH_RX_CTL: R93.2 R98.1 R101.2 ; port ETH.RX_CTL
ETH_RXD0: R89.2 R104.2 ; port ETH.RXD0
ETH_RXD1: R90.2 R103.2 ; port ETH.RXD1
ETH_RXD2: R91.2 R102.2 ; port ETH.RXD2
ETH_RXD3: R92.2 R100.1 ; port ETH.RXD3
ETH_TX_CLK: IC2.33(GTX_CLK/TXC) ; port ETH.TX_CLK
ETH_TX_CTL: IC2.34(TX_EN/TX_CTL) ; port ETH.TX_CTL
ETH_TXD0: IC2.22(TXD0) ; port ETH.TXD0
ETH_TXD1: IC2.23(TXD1) ; port ETH.TXD1
ETH_TXD2: IC2.24(TXD2) ; port ETH.TXD2
ETH_TXD3: IC2.25(TXD3) ; port ETH.TXD3
LED1: IC2.21(LED1/GPIO0/PHYAD0/LEDPOL1) R106.1 R110.2 T10.1(G)
LED2: IC2.19(LED2/GPIO1/PHYAD1/LEDPOL2) R107.1 R111.2 T9.1(G)
LED_MODE: IC2.57(CLK125_NDO/GPIO6/LED_MODE) R105.1
MAGJACK: IC2.17(LED4/GPIO3/MAGJACK/LEDPOL4) R108.1 R113.2
PHY_GPIO_RST: IC2.53(COL/GPIO9)
PHY_RESET_N: IC2.58(RESET_N) R109.1 ; port ETH.RESETn  [project net MIO61]
PHYAD2: IC2.18(LED3/GPIO2/PHYAD2/LEDPOL3) R94.1
PHYAD3: IC2.37(RXD6/PHYAD3) R95.1
PHYAD4: IC2.38(RXD5/PHYAD4) R96.1
RGMII_EN: IC2.39(RXD4/RGMII_EN) R97.1
RX_CTL_R: IC2.46(RX_DV/RX_CTL/CLK125_EN) R93.1
RXC_R: IC2.49(RX_CLK/RXC/MODE4) R88.1
RXD0_R: IC2.45(RXD0/MODE0) R89.1
RXD1_R: IC2.44(RXD1/MODE1) R90.1
RXD2_R: IC2.42(RXD2/MODE2) R91.1
RXD3_R: IC2.41(RXD3/MODE3) R92.1
TXRXA_N: IC2.4(TXRXM_A) J3.2(TD1-)
TXRXA_P: IC2.3(TXRXP_A) J3.1(TD1+)
TXRXB_N: IC2.8(TXRXM_B) J3.4(TD2-)
TXRXB_P: IC2.7(TXRXP_B) J3.3(TD2+)
TXRXC_N: IC2.10(TXRXM_C) J3.8(TD3-)
TXRXC_P: IC2.9(TXRXP_C) J3.7(TD3+)
TXRXD_N: IC2.14(TXRXM_D) J3.10(TD4-)
TXRXD_P: IC2.13(TXRXP_D) J3.9(TD4+)
NetC44_1: C44.1 J3.5(CT)
NetC45_2: C45.2 IC2.61(XO) Q1.3(X)
NetC46_1: C46.1 IC2.62(XI) Q1.1(X)
NetC47_1: C47.1 J3.6(CT)
NetIC2_64: IC2.64(ISET) R87.2
NetJ3_12: J3.12(LED1K) T9.3(D)
NetJ3_14: J3.14(LED2K) T10.3(D)
NetR85_2: R85.2 T10.2(S)
NetR86_2: R86.2 T9.2(S)

Not connected (* = marked no-connect by the designer): IC2 26(TXD4)* 27(TXD5)* 29(TXD6)* 30(TXD7)* 32(TX_ER/GPIO7)* 36(RXD7)* 48(RX_ER)* 50(CRS/GPIO8)* 54(INT_N/GPIO5)* 59(TX_CLK)* 60(LDO_O)*

### Layout directives
differential pair: TXRXA_N, TXRXA_P, TXRXB_N, TXRXB_P, TXRXC_N, TXRXC_P, TXRXD_N, TXRXD_P

### Notes on the sheet
- (near J3) Please note that RJ45 pinout: 1,2,3,4,5,6,7,8 is actually 1,2,3,6,4,5,7,8.
  Do not connect as shown.
- From reference design <https://ww1.microchip.com/downloads/aemDocuments/documents/UNG/ProductDocuments/BoardDesignFiles/LAN8831+Hardware+Reference+Design+-+RGMII+SCH.PDF>
- (near IC2) 1.8V/2.5V/3.3V
- (near IC2) 1.1V
- 1.1V
- (near IC2) 2.5V/3.3V
- MODE4
- MODE3
- MODE2
- MODE1
- MODE0
- (near IC2) LAN8831 can generate own P1V1 as well, but LDO needs to be powered either from P2V5 or P3V3. We don't have P2V5 close to the chip, so powering from P3V3 would couse much higher power losses.
- ALLPHYAD
  0 = PHY will respond to PHY address 0 as well as it’s assigned
  PHY address
  1 = PHY will respond to only it’s assigned PHY address
  MAGJACK
  ICM/MAGJACK: 0 = ICM with separate center taps, 1 = ICM with shorted center taps
  PHY_RESET_N -> pull-down resistor - [Datasheet] 6.6.2 Power Sequence Timing
- Project/Equipment
- Document
- Designer
- Drawn by
- Check.by
- Copyright WUT ISE 2020.
  This documentation describes Open Hardware and is licensed under the CERN OHL v.1.2. You may redistribute and modify this documentation under the terms of the CERN OHL v.1.2. (http://ohwr.org/CERNOHL). This documentation is distributed WITHOUT ANY EXPRESS OR IMPLIED WARRANTY, INCLUDING OF MERCHANTABILITY, SATISFACTORY QUALITY AND FITNESS FOR A PARTICULAR PURPOSE. Please see the CERN OHL v.1.2 for applicable conditions.
- Contact
- File
- Last Mod.
- Print Date
- Sheet
- Size
- A3
- of
- Rev
- (in symbol ABRACON-ARJM11D7-502-AB-EW2) Green; TX1+; TX1-; TX2+; TX2-; TX3+; TX3-; TX4+; TX4-; Yellow
- (in symbol R0402_10K_1%_0.0625W_100PPM) 1%
- (in symbol R0603_330R_1%_0.1W_100PPM) 1%

### Library data of the parts
C44 C47 C49 C50 C52-C56 C58-C60 C62 C66-C69 = CC0402_100NF_25V_10%_X7R_YUDEN_TMK105B7104KVHF: Non-polarised capacitor; Part Description: SMD Multilayer Chip Ceramic Capacitor (High Dielectric Type) for Automotive / Industrial Applications; Manufacturer: TAIYO YUDEN; Voltage: 25V; TC: X7R; Tolerance: ±10%; Part Number: CC0402_100NF_25V_10%_X7R_YUDEN_TMK105B7104KVHF; Component Kind: Standard; Component Type: Standard; Pin Count: 2; Value: 100nF; Status: Not Recommended; Manufacturer Part Number: TMK105B7104KVHF; Case: 0402; Mounted: Yes; Socket: No; SMD: Yes; HelpURL: \\cern.ch\dfs\Applications\Altium\Datasheets\CC0402_TAIYO-YUDEN_TMK105B7104KVHF.pdf; Author: CERN DEM JLC; CreateDate: 10-May-17; LatestRevisionDate: 10-May-17; Sense: No; ComponentHeight: 0.55mm
C45 C46 = CC0402_12PF_50V_1%_NP0_JOHANSON_R07S: Non-polarised capacitor; Part Description: Ultra High-Q SMD Multilayer Capacitor; Manufacturer: JOHANSON TECHNOLOGY; Manufacturer Part Number: 500R07S120FV4T; Voltage: 50V; TC: C0G/NP0; Tolerance: ±1%; Part Number: CC0402_12PF_50V_1%_NP0_JOHANSON_R07S; Component Kind: Standard; Component Type: Standard; Pin Count: 2; Value: 12pF; Status: Not Recommended; Case: 0402; Mounted: Yes; Socket: No; SMD: Yes; Sense: No; ComponentHeight: 0.61mm; HelpURL: \\cern.ch\dfs\Applications\Altium\Datasheets\CC0402_NP0_JOHANSON_R07S.pdf; Author: CERN DEM BC; CreateDate: 20.11.2017; LatestRevisionDate: 26.09.2018
C48 C51 C57 C65 = CC0402_10UF_6.3V_20%_X5R: Non-polarised capacitor; Part Description: SMD Multilayer Chip Ceramic Capacitor; Manufacturer: GENERIC; Manufacturer1 Part Number: C1005X5R0J106M050; Voltage: 6.3V; TC: X5R; Tolerance: ±10%; Part Number: CC0402_10UF_6.3V_20%_X5R; Component Kind: Standard; Component Type: Standard; Pin Count: 2; Value: 10uF; Status: Preferred; Manufacturer Part Number: CC0402_10UF_6.3V_20%_X5R; Case: 0402; Mounted: Yes; Socket: No; SMD: Yes; Manufacturer1 Example: TDK; Manufacturer1 ComponentHeight: 0.70mm; HelpURL: \\cern.ch\dfs\Applications\Altium\Datasheets\CC0402_X5R_TDK_C.pdf; Author: CERN DEM JLC; CreateDate: 1/7/2015; LatestRevisionDate: 1/7/2015; Sense: No
C61 = CC0402_4.7UF_6.3V_20%_X5R: Non-polarised capacitor; Part Description: SMD Multilayer Chip Ceramic Capacitor; Manufacturer: GENERIC; Manufacturer1 Part Number: C1005X5R0J475M050; Voltage: 6.3V; TC: X5R; Tolerance: ±20%; Part Number: CC0402_4.7UF_6.3V_20%_X5R; Component Kind: Standard; Component Type: Standard; Pin Count: 2; Value: 4.7uF; Status: Preferred; Manufacturer Part Number: CC0402_4.7UF_6.3V_20%_X5R; Case: 0402; Mounted: Yes; Socket: No; SMD: Yes; Sense: No; Manufacturer1 Example: TDK; Manufacturer1 ComponentHeight: 0.65mm; HelpURL: \\cern.ch\dfs\Applications\Altium\Datasheets\CC0402_X5R_TDK_C.pdf; Author: CERN DEM JLC; CreateDate: 3/3/2015; LatestRevisionDate: 3/3/2015
C63 = CC0402_10NF_16V_10%_X7R: Non-polarised capacitor; Part Description: SMD Multilayer Chip Ceramic Capacitor; Manufacturer: GENERIC; Manufacturer1 Part Number: 223878715636; Voltage: 16V; TC: X7R; Tolerance: ±10%; Part Number: CC0402_10NF_16V_10%_X7R; Component Kind: Standard; Component Type: Standard; Pin Count: 2; Value: 10nF; Status: Not Recommended; Manufacturer Part Number: CC0402_10NF_16V_10%_X7R; Case: 0402; Mounted: Yes; Socket: No; SMD: Yes; Sense: No; Manufacturer1 Example: PHYCOMP; Manufacturer1 ComponentHeight: 0.55mm; HelpURL: \\cern.ch\dfs\Applications\Altium\Datasheets\CC0402_X7R_PHYCOMP.pdf; Author: CERN DEM JLC; CreateDate: 03.12.2007; LatestRevisionDate: 03.12.2007
IC2 = LAN8831/Q2A: Gigabit Ethernet Transceiver with GMII/MII/RGMII; Manufacturer: MICROCHIP TECHNOLOGY; PressFit: No; Bonding: No; Part Number: LAN8831/Q2A; Component Kind: Standard; Component Type: Standard; Device: LAN8831/Q2A; PackageDescription: QFN, 0.40mm Pitch, Square; 64 Pin, 8.00mm L X 8.00mm W X 0.90mm H body (w/Thermal Tab 6.55 X 6.55mm), IPC Medium Density; Part Description: Gigabit Ethernet Transceiver with GMII/MII/RGMII; Manufacturer Part Number: LAN8831/Q2A; Pin Count: 65; Case: QFN64; Mounted: Yes; Socket: No; SMD: Yes; Sense: No; ComponentHeight: 0.9mm; Author: CERN DEM HF; HelpURL: \\cern.ch\dfs\Applications\Altium\Datasheets\LAN8831.pdf; CreateDate: 29.09.2023; LatestRevisionDate: 03.10.2023
J3 = ABRACON-ARJM11D7-502-AB-EW2: 1 Port, Green/Yellow LEDs, RJ45 1Gigabit Ethernet, MagJack Connector Module; Part Description: DC-10MBd Versatile Link Fiber Optic Analog Transmitter for 1 mm POF and 200 µm PCS; PressFit: No; Part Number: ABRACON-ARJM11D7-502-AB-EW2; Component Kind: Standard; Component Type: Standard; Device: ARJM11D7-502-AB-EW2; Pin Count: 14; Family: RJ45; Mounted: Yes; Socket: No; SMD: No; Sense: No; Status: None; Manufacturer: ABRACON; Manufacturer Part Number: ARJM11D7-502-AB-EW2; ComponentHeight: 13.8mm; HelpURL: \\cern.ch\dfs\Applications\Altium\Datasheets\ARJM11D7-502-AB-EW2.pdf; Author: CERN DEM HF; CreateDate: 29.09.2023; LatestRevisionDate: 29.09.2023
L11-L15 = IND0805_MURATA_BLM21PG221SN1D: Inductor; Part Description: SMD EMIFIL Suppression Chip Ferrite Bead; Manufacturer: MURATA; Power: 2A; Resistance: 0.05R; Tolerance: ±25%; Part Number: IND0805_MURATA_BLM21PG221SN1D; Component Kind: Standard; Component Type: Standard; Pin Count: 2; Value: 220R@100MHz; Manufacturer Part Number: BLM21PG221SN1; Case: 0805; Mounted: Yes; Socket: No; SMD: Yes; Sense: No; ComponentHeight: 1.05mm; HelpURL: \\cern.ch\dfs\Applications\Altium\Datasheets\IND0805_MURATA_BLM21P.pdf; Author: CERN DEM JLC; CreateDate: 1/25/2010; LatestRevisionDate: 10/25/2018
Q1 = XTAL_25MHZ_NDK_NX3225GA: Crystal 4 pins 1=XTAL Control 2=GND3=XTAL 4=GND; Part Description: Tolerance: ±20ppm, Stability: ±30ppm, -40°C to +85°C, 8pF, 50 Ohms ESR, Automotive Quartz Crystal, NX3225GA Series; Manufacturer: NDK; Manufacturer Part Number: NX3225GA-25.000M-STD-CRG; PressFit: No; Bonding: No; Part Number: XTAL_25MHZ_NDK_NX3225GA; Component Kind: Standard; Component Type: Standard; PackageDescription: 4 Pins, SMD Crystal, Body 2.5x3.2mm, NX3225GA Series; Value: 25MHz; Pin Count: 4; Mounted: Yes; Socket: No; SMD: Yes; Sense: No; ComponentHeight: 0.9mm; HelpURL: \\cern.ch\dfs\Applications\Altium\Datasheets\XTAL_NDK_NX3225GA.pdf; Author: CERN DEM MR; CreateDate: 15.02.2018; LatestRevisionDate: 15.02.2018
R83 R84 R101 R110 R111 R113 = R0402_1K_1%_0.0625W_100PPM: Resistor - 1%; Part Description: General Purpose Thick Film Chip Resistor; Manufacturer: GENERIC; Manufacturer1 Part Number: 232270671002L; TC: ±100ppm/°C; PressFit: No; Part Number: R0402_1K_1%_0.0625W_100PPM; Component Kind: Standard; Component Type: Standard; Pin Count: 2; Value: 1k; Status: Not Recommended; Power: 0.0625W; Manufacturer Part Number: R0402_1K_1%_0.0625W_100PPM; Case: 0402; Mounted: Yes; Sense: No; Socket: No; SMD: Yes; Manufacturer1 Example: YAGEO PHYCOMP; Manufacturer1 ComponentHeight: 0.4mm; HelpURL: \\cern.ch\dfs\Applications\Altium\Datasheets\R0402_Phycomp_RC0402.pdf; Author: CERN DEM JLC; CreateDate: 03.12.2007; LatestRevisionDate: 17.10.2012
R85 R86 = R0603_330R_1%_0.1W_100PPM: Resistor - 1%; Part Description: General Purpose Thick Film Chip Resistor; Manufacturer: GENERIC; Manufacturer1 Part Number: NRC06F3300TRF; Power: 0.1W; TC: ±100ppm/°C; PressFit: No; Part Number: R0603_330R_1%_0.1W_100PPM; Component Kind: Standard; Component Type: Standard; Pin Count: 2; Value: 330; Status: Preferred; Tolerance: ±1%; Manufacturer Part Number: R0603_330R_1%_0.1W_100PPM; Case: 0603; Mounted: Yes; Socket: No; SMD: Yes; Manufacturer1 Example: NIC COMPONENT; Manufacturer1 ComponentHeight: 0.55mm; HelpURL: \\cern.ch\dfs\Applications\Altium\Datasheets\R0603_NIC_NRC.pdf; Author: CERN DEM JLC; CreateDate: 03-Dec-07; LatestRevisionDate: 13-Mar-08; Sense: No
R87 = R0603_6K04_0.1%_0.063W_10PPM: Resistor - 0.1%; Part Description: Thin Film Chip Resistor; Manufacturer: GENERIC; Manufacturer1 Part Number: RN73C1J6K04BTDF; Power: 0.063W; TC: ±10ppm; PressFit: No; Part Number: R0603_6K04_0.1%_0.063W_10PPM; Component Kind: Standard; Component Type: Standard; Pin Count: 2; Value: 6k04; Status: Not Recommended; Manufacturer Part Number: R0603_6K04_0.1%_0.063W_10PPM; Case: 0603; Mounted: Yes; Sense: No; Socket: No; SMD: Yes; Manufacturer1 Example: TYCO HOLSWORTHY; Manufacturer1 ComponentHeight: 0.5mm; HelpURL: \\cern.ch\dfs\Applications\Altium\Datasheets\R0603_Tyco_RN73.pdf; Author: CERN DEM JLC; CreateDate: 03.12.2007; LatestRevisionDate: 13.03.2008
R88-R93 = R0402_22R_1%_0.0625W_100PPM: Resistor - 1%; Part Description: General Purpose Thick Film Chip Resistor; Manufacturer: GENERIC; Manufacturer1 Part Number: 232270672209L; TC: ±100ppm/°C; PressFit: No; Part Number: R0402_22R_1%_0.0625W_100PPM; Component Kind: Standard; Component Type: Standard; Pin Count: 2; Value: 22; Status: Not Recommended; Power: 0.0625W; Manufacturer Part Number: R0402_22R_1%_0.0625W_100PPM; Case: 0402; Mounted: Yes; Sense: No; Socket: No; SMD: Yes; Manufacturer1 Example: YAGEO PHYCOMP; Manufacturer1 ComponentHeight: 0.4mm; HelpURL: \\cern.ch\dfs\Applications\Altium\Datasheets\R0402_Phycomp_RC0402.pdf; Author: CERN DEM JLC; CreateDate: 03.12.2007; LatestRevisionDate: 17.10.2012
R94-R100 R102-R109 R112 R139#1 R140#1 = R0402_10K_1%_0.0625W_100PPM: as R70 on sheet Connector_SFP; Part Number: R0402_10K_1%_0.0625W_100PPM; Component Kind: Standard; Component Type: Standard; Pin Count: 2; Value: 10k; Status: Not Recommended; Power: 0.0625W; Manufacturer Part Number: R0402_10K_1%_0.0625W_100PPM; Case: 0402; Mounted: Yes; Sense: No; Socket: No; SMD: Yes; Manufacturer1 Example: YAGEO PHYCOMP; Manufacturer1 ComponentHeight: 0.4mm; HelpURL: \\cern.ch\dfs\Applications\Altium\Datasheets\R0402_Phycomp_RC0402.pdf; Author: CERN DEM JLC; CreateDate: 03.12.2007; LatestRevisionDate: 17.10.2012
  R139#1 R140#1: Tolerance: ±1%
T9 T10 = BSH103: as T7 on sheet Connector_SFP; Part Number: BSH103; Component Kind: Standard; Component Type: Standard; Device: BSH103; PackageDescription: SOT23, 0.95mm Pitch; 3 Pin, 1.30mm W X 2.90mm L X 1.10mm H body, IPC Medium Density; Manufacturer Part Number: BSH103; Pin Count: 3; Case: SOT23-3; Mounted: Yes; Socket: No; SMD: Yes; Sense: No; ComponentHeight: 1.1mm; HelpURL: \\cern.ch\dfs\Applications\Altium\Datasheets\BSH103.pdf; Author: CERN DEM JLC; CreateDate: 16.03.2010; LatestRevisionDate: 20.06.2017